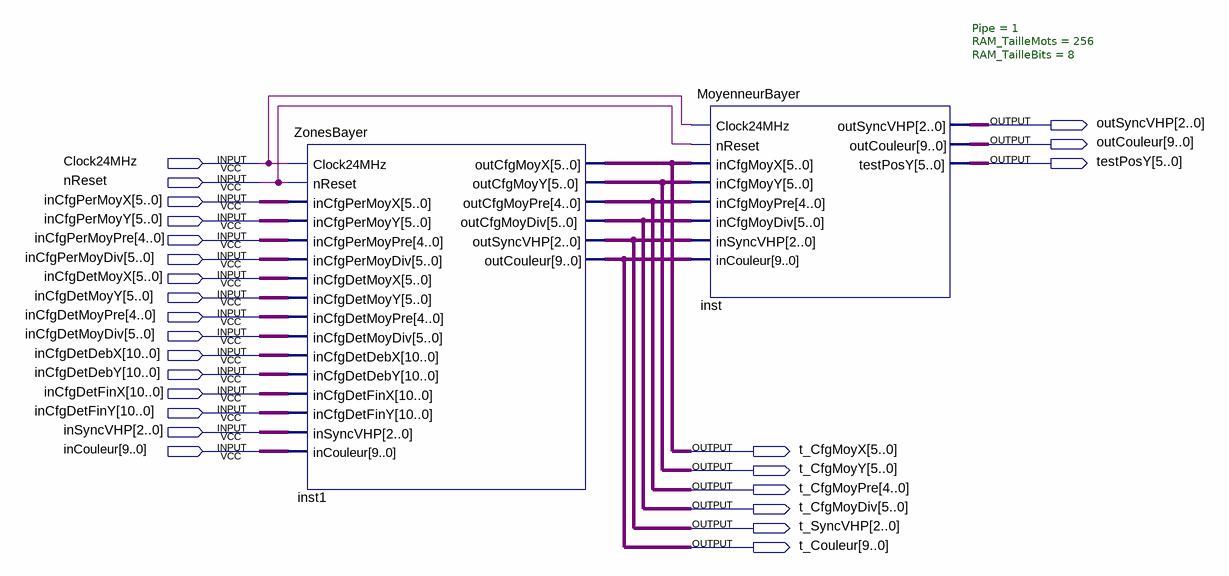
[diagram p0: schematic sheet]
// Quartus schematic EtZoneBayer.bdf as structural Verilog: 2 symbols, 25 pins
module EtZoneBayer (
  input  Clock24MHz,
  input  nReset,
  input  [5:0] inCfgPerMoyX,
  input  [5:0] inCfgPerMoyY,
  input  [4:0] inCfgPerMoyPre,
  input  [5:0] inCfgPerMoyDiv,
  input  [5:0] inCfgDetMoyX,
  input  [5:0] inCfgDetMoyY,
  input  [4:0] inCfgDetMoyPre,
  input  [5:0] inCfgDetMoyDiv,
  input  [10:0] inCfgDetDebX,
  input  [10:0] inCfgDetDebY,
  input  [10:0] inCfgDetFinX,
  input  [10:0] inCfgDetFinY,
  input  [2:0] inSyncVHP,
  input  [9:0] inCouleur,
  output [2:0] outSyncVHP,
  output [9:0] outCouleur,
  output [5:0] testPosY,
  output [5:0] t_CfgMoyX,
  output [5:0] t_CfgMoyY,
  output [4:0] t_CfgMoyPre,
  output [5:0] t_CfgMoyDiv,
  output [2:0] t_SyncVHP,
  output [9:0] t_Couleur
);

  ZonesBayer inst1 (
    .Clock24MHz(Clock24MHz), .nReset(nReset), .inCfgPerMoyX(inCfgPerMoyX), .inCfgPerMoyY(inCfgPerMoyY),
    .inCfgPerMoyPre(inCfgPerMoyPre), .inCfgPerMoyDiv(inCfgPerMoyDiv), .inCfgDetMoyX(inCfgDetMoyX),
    .inCfgDetMoyY(inCfgDetMoyY), .inCfgDetMoyPre(inCfgDetMoyPre), .inCfgDetMoyDiv(inCfgDetMoyDiv),
    .inCfgDetDebX(inCfgDetDebX), .inCfgDetDebY(inCfgDetDebY), .inCfgDetFinX(inCfgDetFinX),
    .inCfgDetFinY(inCfgDetFinY), .inSyncVHP(inSyncVHP), .inCouleur(inCouleur), .outCfgMoyX(t_CfgMoyX),
    .outCfgMoyY(t_CfgMoyY), .outCfgMoyPre(t_CfgMoyPre), .outCfgMoyDiv(t_CfgMoyDiv), .outSyncVHP(t_SyncVHP),
    .outCouleur(t_Couleur));
  MoyenneurBayer #(.Pipe(1), .RAM_TailleMots(256), .RAM_TailleBits(8)) inst (
    .Clock24MHz(Clock24MHz), .nReset(nReset), .inCfgMoyX(t_CfgMoyX), .inCfgMoyY(t_CfgMoyY),
    .inCfgMoyPre(t_CfgMoyPre), .inCfgMoyDiv(t_CfgMoyDiv), .inSyncVHP(t_SyncVHP), .inCouleur(t_Couleur),
    .outSyncVHP(outSyncVHP), .outCouleur(outCouleur), .testPosY(testPosY));
endmodule
